# Altium schematic sheet 漏电流检测.SchDoc
size A4
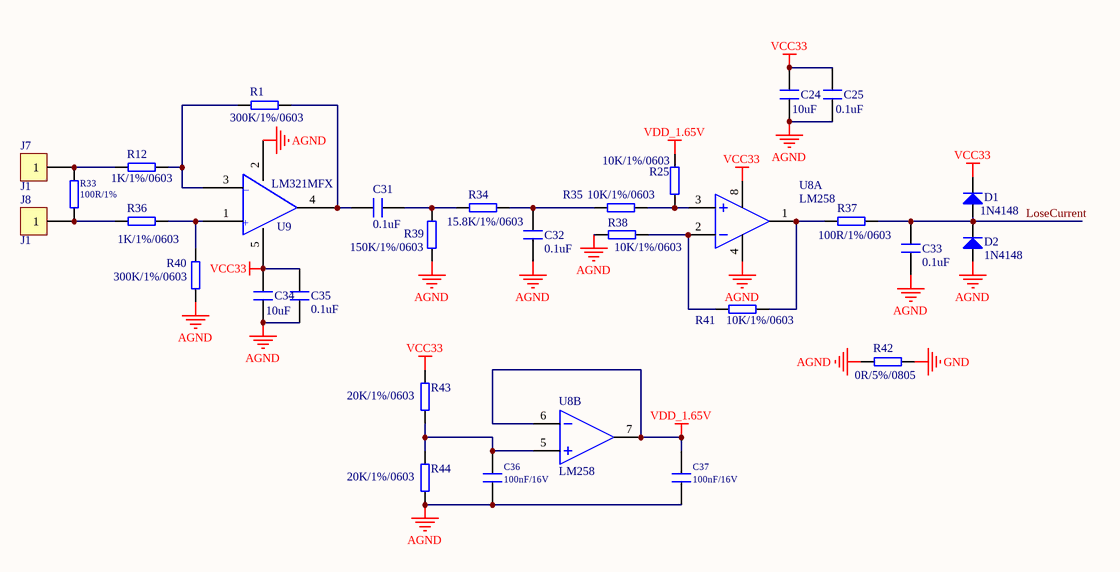
[diagram p0: 漏电流检测.SchDoc]

## Parts
C24  10uF  [0603R]
C25  0.1uF  [0603R]
C31  0.1uF  [0603R]
C32  0.1uF  [0603R]
C33  0.1uF  [0603R]
C34  10uF  [0603R]
C35  0.1uF  [0603R]
C36  100nF/16V  [0603R]
C37  100nF/16V  [0603R]
D1  1N4148  [1206D]
D2  1N4148  [1206D]
J7  J1  [贴片焊盘V1（3*2椭圆）]
J8  J1  [贴片焊盘V1（3*2椭圆）]
R1  300K/1%/0603  [0603r]
R12  1K/1%/0603  [0603r]
R25  10K/1%/0603  [0603r]
R33  100R/1%  [0805R]
R34  15.8K/1%/0603  [0603r]
R35  10K/1%/0603  [0603r]
R36  1K/1%/0603  [0603r]
R37  100R/1%/0603  [0603r]
R38  10K/1%/0603  [0603r]
R39  150K/1%/0603  [0603r]
R40  300K/1%/0603  [0603r]
R41  10K/1%/0603  [0603r]
R42  0R/5%/0805  [0805R]
R43  20K/1%/0603  [0603r]
R44  20K/1%/0603  [0603r]
U8  LM258  [SO8]  (parts A,B of 2)
U9  LM321MFX  [SOT-23-5]

## Nets
AGND: C24.1 C25.1 C32.2 C33.2 C34.1 C35.1 C36.2 C37.2 D2.2(A) R38.2 R39.1 R40.1 R42.2 R44.2 U8.4 U9.2
GND: R42.1
VCC33: C24.2 C25.2 C34.2 C35.2 D1.1(K) R43.1 U8.8 U9.5
VDD_1.65V: C37.1 R25.1 U8.6 U8.7
LoseCurrent: C33.1 D1.2(A) D2.1(K) R37.1
NetC31_1: C31.1 R34.2 R39.2
NetC31_2: C31.2 R1.1 U9.4
NetC32_1: C32.1 R34.1 R35.2
NetC36_1: C36.1 R43.2 R44.1 U8.5
NetJ7_1: J7.1 R12.1 R33.2
NetJ8_1: J8.1 R33.1 R36.2
NetR1_2: R1.2 R12.2 U9.3
NetR25_2: R25.2 R35.1 U8.3
NetR36_1: R36.1 R40.2 U9.1
NetR37_2: R37.2 R41.1 U8.1
NetR38_1: R38.1 R41.2 U8.2

## Notes on the sheet
- (in symbol LM321MFX) _; +

## Library data of the parts
C24 C25 C31-C37 = CAP
D1 D2 = DIODE
R1 R12 R25 R33-R44 = RES
U8 = LM358